# Altium schematic sheet MC-306LS-H50_2024-12-15.schdoc
size 54 x 37 mm
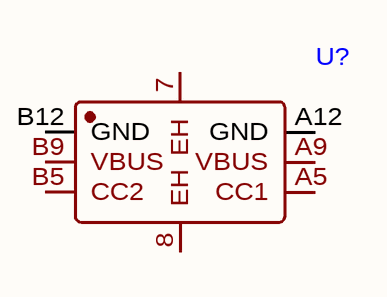
[diagram p0: MC-306LS-H50_2024-12-15.schdoc]

## Parts
U?  (no value)  [TYPE-C-SMD_MC-306LS-H50]

## Nets

Not connected (* = marked no-connect by the designer): U? 7(EH) 8(EH) A5(CC1) A9(VBUS) A12(GND) B5(CC2) B9(VBUS) B12(GND)

## Library data of the parts
U? = MC-306LS-H50